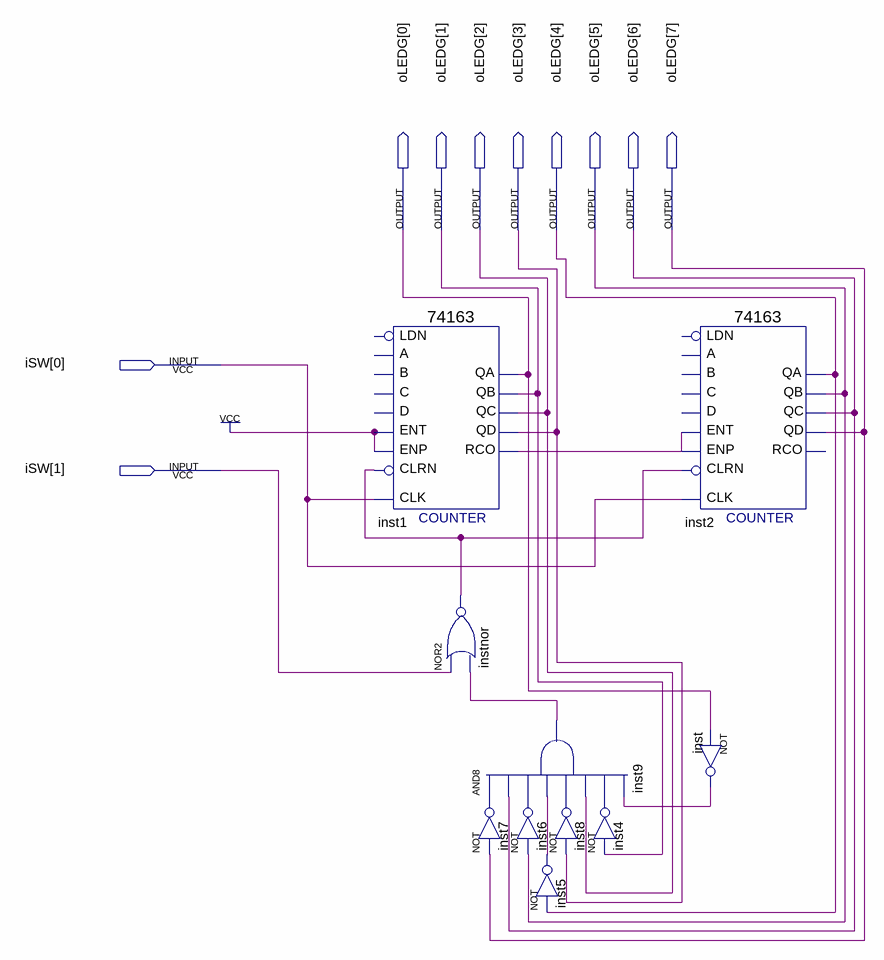
[diagram p0: schematic sheet]
// Quartus schematic Cwiczenie3_3.bdf as structural Verilog: 10 symbols, 10 pins
module Cwiczenie3_3 (
  input  [1:0] iSW,
  output [7:0] oLEDG
);

  wire inst1_rco, inst4_out, inst5_out, inst6_out, inst7_out, inst8_out, inst9_out, inst_out, instnor_out;

  \74163  inst1 (
    .ENT(1'b1), .CLRN(instnor_out), .CLK(iSW[0]), .ENP(1'b1), .QA(oLEDG[0]), .QB(oLEDG[1]), .QC(oLEDG[2]),
    .QD(oLEDG[3]), .RCO(inst1_rco));  // open: C, B, A, D, LDN
  nor instnor (instnor_out, iSW[1], inst9_out);
  and inst9 (inst9_out, inst7_out, oLEDG[6], inst6_out, inst5_out, inst8_out, oLEDG[2], inst4_out, inst_out);
  not inst6 (inst6_out, oLEDG[5]);
  not inst7 (inst7_out, oLEDG[7]);
  not inst5 (inst5_out, oLEDG[4]);
  not inst4 (inst4_out, oLEDG[1]);
  not inst8 (inst8_out, oLEDG[3]);
  \74163  inst2 (
    .ENT(inst1_rco), .CLRN(instnor_out), .CLK(iSW[0]), .ENP(inst1_rco), .QA(oLEDG[4]), .QB(oLEDG[5]),
    .QC(oLEDG[6]), .QD(oLEDG[7]));  // open: C, B, A, D, LDN, RCO
  not inst (inst_out, oLEDG[0]);
endmodule
